# Altium schematic sheet Ohmmeter Design.SchDoc
size A; SheetNumber: 3; SheetTotal: 10
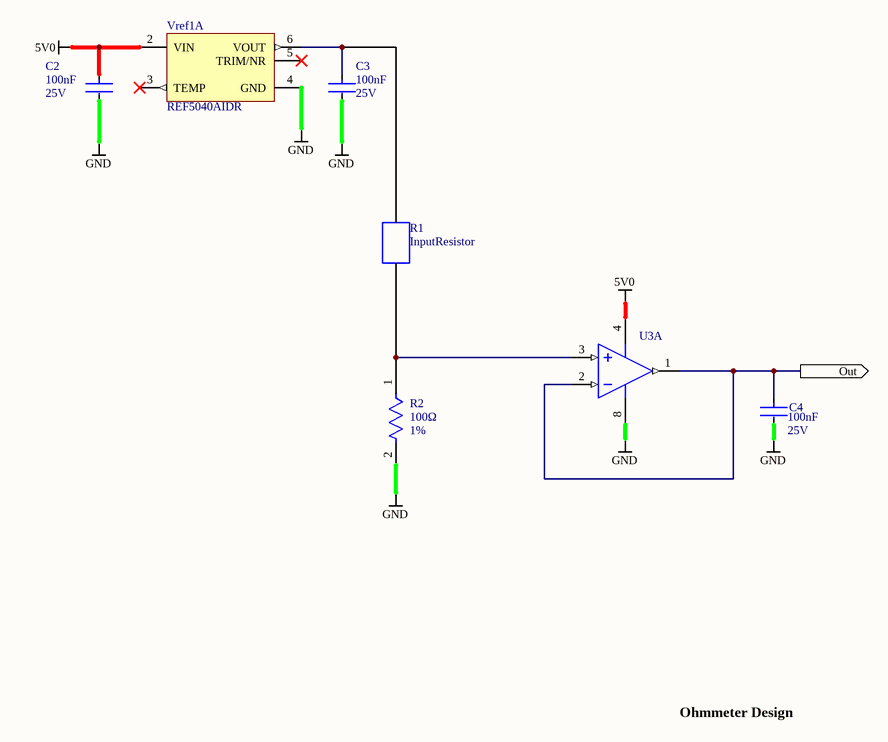
[diagram p0: Ohmmeter Design.SchDoc]

## Parts
C2  Voltage: 25V  Capacitance: 100nF  [FP-CL278-IPC_C]  (hidden comment: 0.1 uF)
C3  Voltage: 25V  Capacitance: 100nF  [FP-CL278-IPC_C]  (hidden comment: 0.1uF)
C4  Voltage: 25V  Capacitance: 100nF  [FP-CL278-IPC_C]  (hidden comment: CL05A104KA5NNNC)
R1  InputResistor  [UserInputResistor]
R2  value 100Ω  Tolerance: 1%  [FP-ERJ1GN-MFG]  (hidden comment: 100 Ohm)
U3  OPA2330AIDGKR  [DGK0008A_M]  (value not drawn)  (part A of 2)
Vref1  REF5040AIDR  [D0008A_M]  (part A of 2)

## Ports
Out (out)

## Nets
5V0: C2.1 U3.4(V-) Vref1.2(VIN)
GND: C2.2 C3.2 C4.2 R2.2 U3.8(V+) Vref1.4(GND)
Out: C4.1 U3.1(OUT_A) U3.2(IN_A-) ; port Out
NetC3_1: C3.1 R1.2 Vref1.6(VOUT)
NetR1_1: R1.1 R2.1 U3.3(IN_A+)

Not connected (* = marked no-connect by the designer): Vref1 3(TEMP)* 5(TRIM/NR)*

## Notes on the sheet
- Ohmmeter Design

## Library data of the parts
C2-C4 = CMP-13271-000728-1: Cap Ceramic 100nF 25V X5R ±10% SMD 0402 +85°C Paper T/R; Package Quantity: 1; Height: 0.5mm; Case Code (Metric): 1005; Thickness: 0.022inch; Mount: Surface Mount; Lead Free: Lead Free; Case Code (Imperial): 0402; Packaging: Tape and Reel; Depth: 0.5mm; Min Operating Temperature: -55°C; Voltage Rating: 25V; Dielectric: X5R; Case/Package: 0402; Tolerance: 10%; Width: 0.02inch; Max Operating Temperature: 85°C; Length: 1mm; Radiation Hardening: No; Voltage Rating (DC): 25V
R2 = CMP-2004-03443-2: RES SMD 100 OHM 1% 1/20W 0201; Manufacturer: Panasonic Electronic Components; Manufacturer Part Number: ERJ-1GNF1000C; Automotive Grade: Grade 1; Temperature Coefficient: 200ppm/°C; Power Rating: 0.05W; Voltage Rating: 25V; Height: 0.26mm; Series: ERJ; Category: Res; Device Class L3: Chip SMD Resistors; Octopart: https://octopart.com/erj-1gnf1000c-panasonic-55419695; ComponentLink2URL: https://industrial.panasonic.com/cdbs/www-data/pdf/RDA0000/AOA0000C304.pdf; Footprint Url: https://industrial.panasonic.com/cdbs/www-data/pdf/RDA0000/DMA0000COL17.pdf; Digikey Description: RES SMD 100 OHM 1% 1/20W 0201; Temperature Range Low: -55°C; Mouser Description: Thick Film Resistors 0201 100ohm 1% HalogenFree AEC-Q200; Temperature: -55°C to +125°C; Device Class L2: Resistors; Package: ERJ1GN; Lead Free: Yes; Resistance: 100Ω; Composition: Thick Film; Automotive: Yes; Temperature Range High: +125°C; Device Class L1: Passive Components; ComponentLink2Description: Datasheet; RoHS: TRUE
U3 = CMP-0272-01264-3: 35 uA, MicroPower, Precision, Zero Drift CMOS Operational Amplifier, 1.8 to 5.5 V, -40 to 125 degC, 8-pin SOP (DGK8), Green (RoHS & no Sb/Br); Manufacturer: Texas Instruments; Total Supply Voltage(Max)(+5V is 5, +/-5V is 10): 5.5; CMRR(Min)(dB): 100; Number of Channels: 2; IIB(Max)(pA): 500; Total Supply Voltage(Min)(+5V is 5, +/-5V is 10): 1.8; Sub Family: Low Offset Voltage Amplifier (<=500uV), Low Power Amp (<=500uA), Low Supply Voltage Amplifier (<=2.7V), Precision Amplifier, Zero Drift Precision Amplifier; Offset Drift(Typ)(uV/C): 0.02; Slew Rate(Typ)(V/us): 0.16; Vn at 1kHz(Typ)(nV/rtHz): 55; Iq per channel(Max)(mA): 0.035; Vio (25C)(Max)(mV): 0.05; PackageReference: DGK0008A; ComponentLink3Description: Package Specification; Mounting Technology: Surface Mount; DatasheetVersion: SBOS432E; PackageVersion: 4073329/E, 05/2006; PackageDescription: 8-Pin Thin Small Outline, Body 3 x 3 mm, Pitch 0.65 mm; ComponentLink2URL: http://www.ti.com/general/docs/lit/getliterature.tsp?genericPartNumber=OPA2330&fileType=pdf; ComponentLink1URL: http://www.ti.com/; Eco-Plan: Green (RoHS & no Sb/Br); Code_JEDEC: MO-187; ComponentLink2Description: Datasheet; ComponentLink3URL: http://www.ti.com/litv/pdf/mpds028d; PartNumber: OPA2330AIDGKR; ComponentLink1Description: Manufacturer URL
Vref1 = CMP-0367-00019-2: Low Noise, Very Low Drift, Precision Voltage Reference, -40 to 125 degC, 8-pin SOIC (D), Green (RoHS & no Sb/Br); Manufacturer: Texas Instruments; Initial Accuracy @ 25/deg C(%): 0.05; VO(V): 4.096; VI(Max)(V): 18; Temp Coeff(Max)(ppm/ degree C): 3; Iq(Max)(uA): 1000; VI(Min)(V): 4.296; Rating: Catalog; SubFamily: Series Voltage Reference; Iout/Iz(Max)(mA): 10; PartNumber: REF5040AIDR; Code_JEDEC: MS-012; PackageReference: D0008A; PackageDescription: 8-Pin Plastic Small Outline, Body 4.9 x 3.9 mm, Pitch 1.27 mm; ComponentLink3Description: Package Specification; Mounting Technology: Surface Mount; ComponentLink2Description: Datasheet; PackageVersion: 4040047-3/M; ComponentLink1URL: http://www.ti.com/; ComponentLink1Description: Manufacturer URL; ComponentLink2URL: http://www.ti.com/general/docs/lit/getliterature.tsp?genericPartNumber=REF5040&fileType=pdf; ComponentLink3URL: http://www.ti.com/litv/pdf/msoi002j; Eco-Plan: Green (RoHS & no Sb/Br); DatasheetVersion: SBOS410E